# Altium schematic sheet Top.SchDoc
size A; SheetNumber: 1; SheetTotal: 6
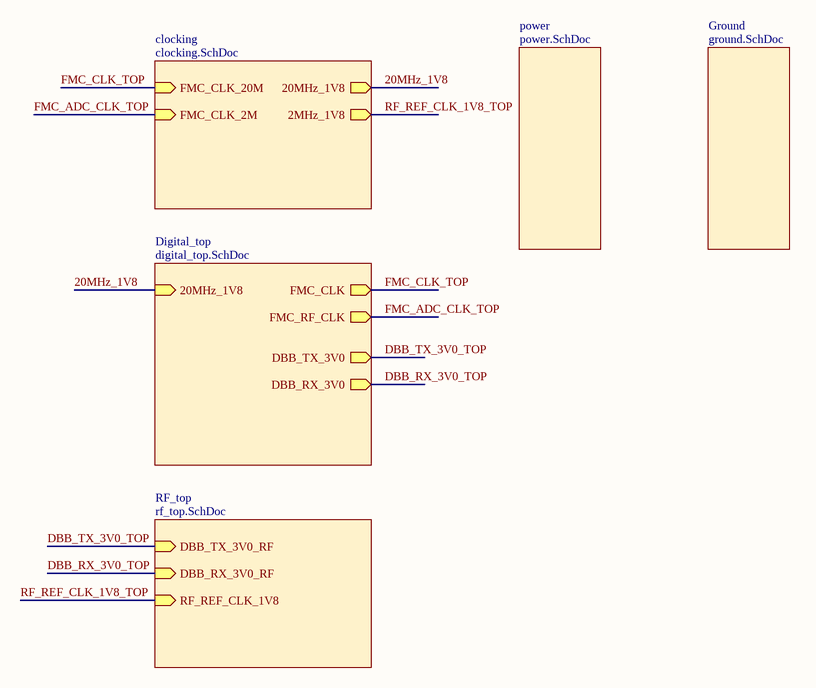
[diagram p0: Top.SchDoc]

## Sub-sheets
clocking = clocking.SchDoc: 20MHz_1V8 (out), FMC_CLK_20M (in), FMC_CLK_2M (in), 2MHz_1V8 (out)
Digital_top = digital_top.SchDoc: 20MHz_1V8 (in), FMC_CLK (out), FMC_RF_CLK (out), DBB_RX_3V0 (out), DBB_TX_3V0 (out)
Ground = ground.SchDoc: no entries
power = power.SchDoc: no entries
RF_top = rf_top.SchDoc: DBB_TX_3V0_RF (in), DBB_RX_3V0_RF (in), RF_REF_CLK_1V8 (in)

## Nets
20MHz_1V8: sheet Digital_top/20MHz_1V8, sheet clocking/20MHz_1V8
DBB_RX_3V0_TOP: sheet Digital_top/DBB_RX_3V0, sheet RF_top/DBB_RX_3V0_RF
DBB_TX_3V0_TOP: sheet Digital_top/DBB_TX_3V0, sheet RF_top/DBB_TX_3V0_RF
FMC_ADC_CLK_TOP: sheet Digital_top/FMC_RF_CLK, sheet clocking/FMC_CLK_2M
FMC_CLK_TOP: sheet Digital_top/FMC_CLK, sheet clocking/FMC_CLK_20M
RF_REF_CLK_1V8_TOP: sheet RF_top/RF_REF_CLK_1V8, sheet clocking/2MHz_1V8